# Altium project PCB_Project.PrjPcb
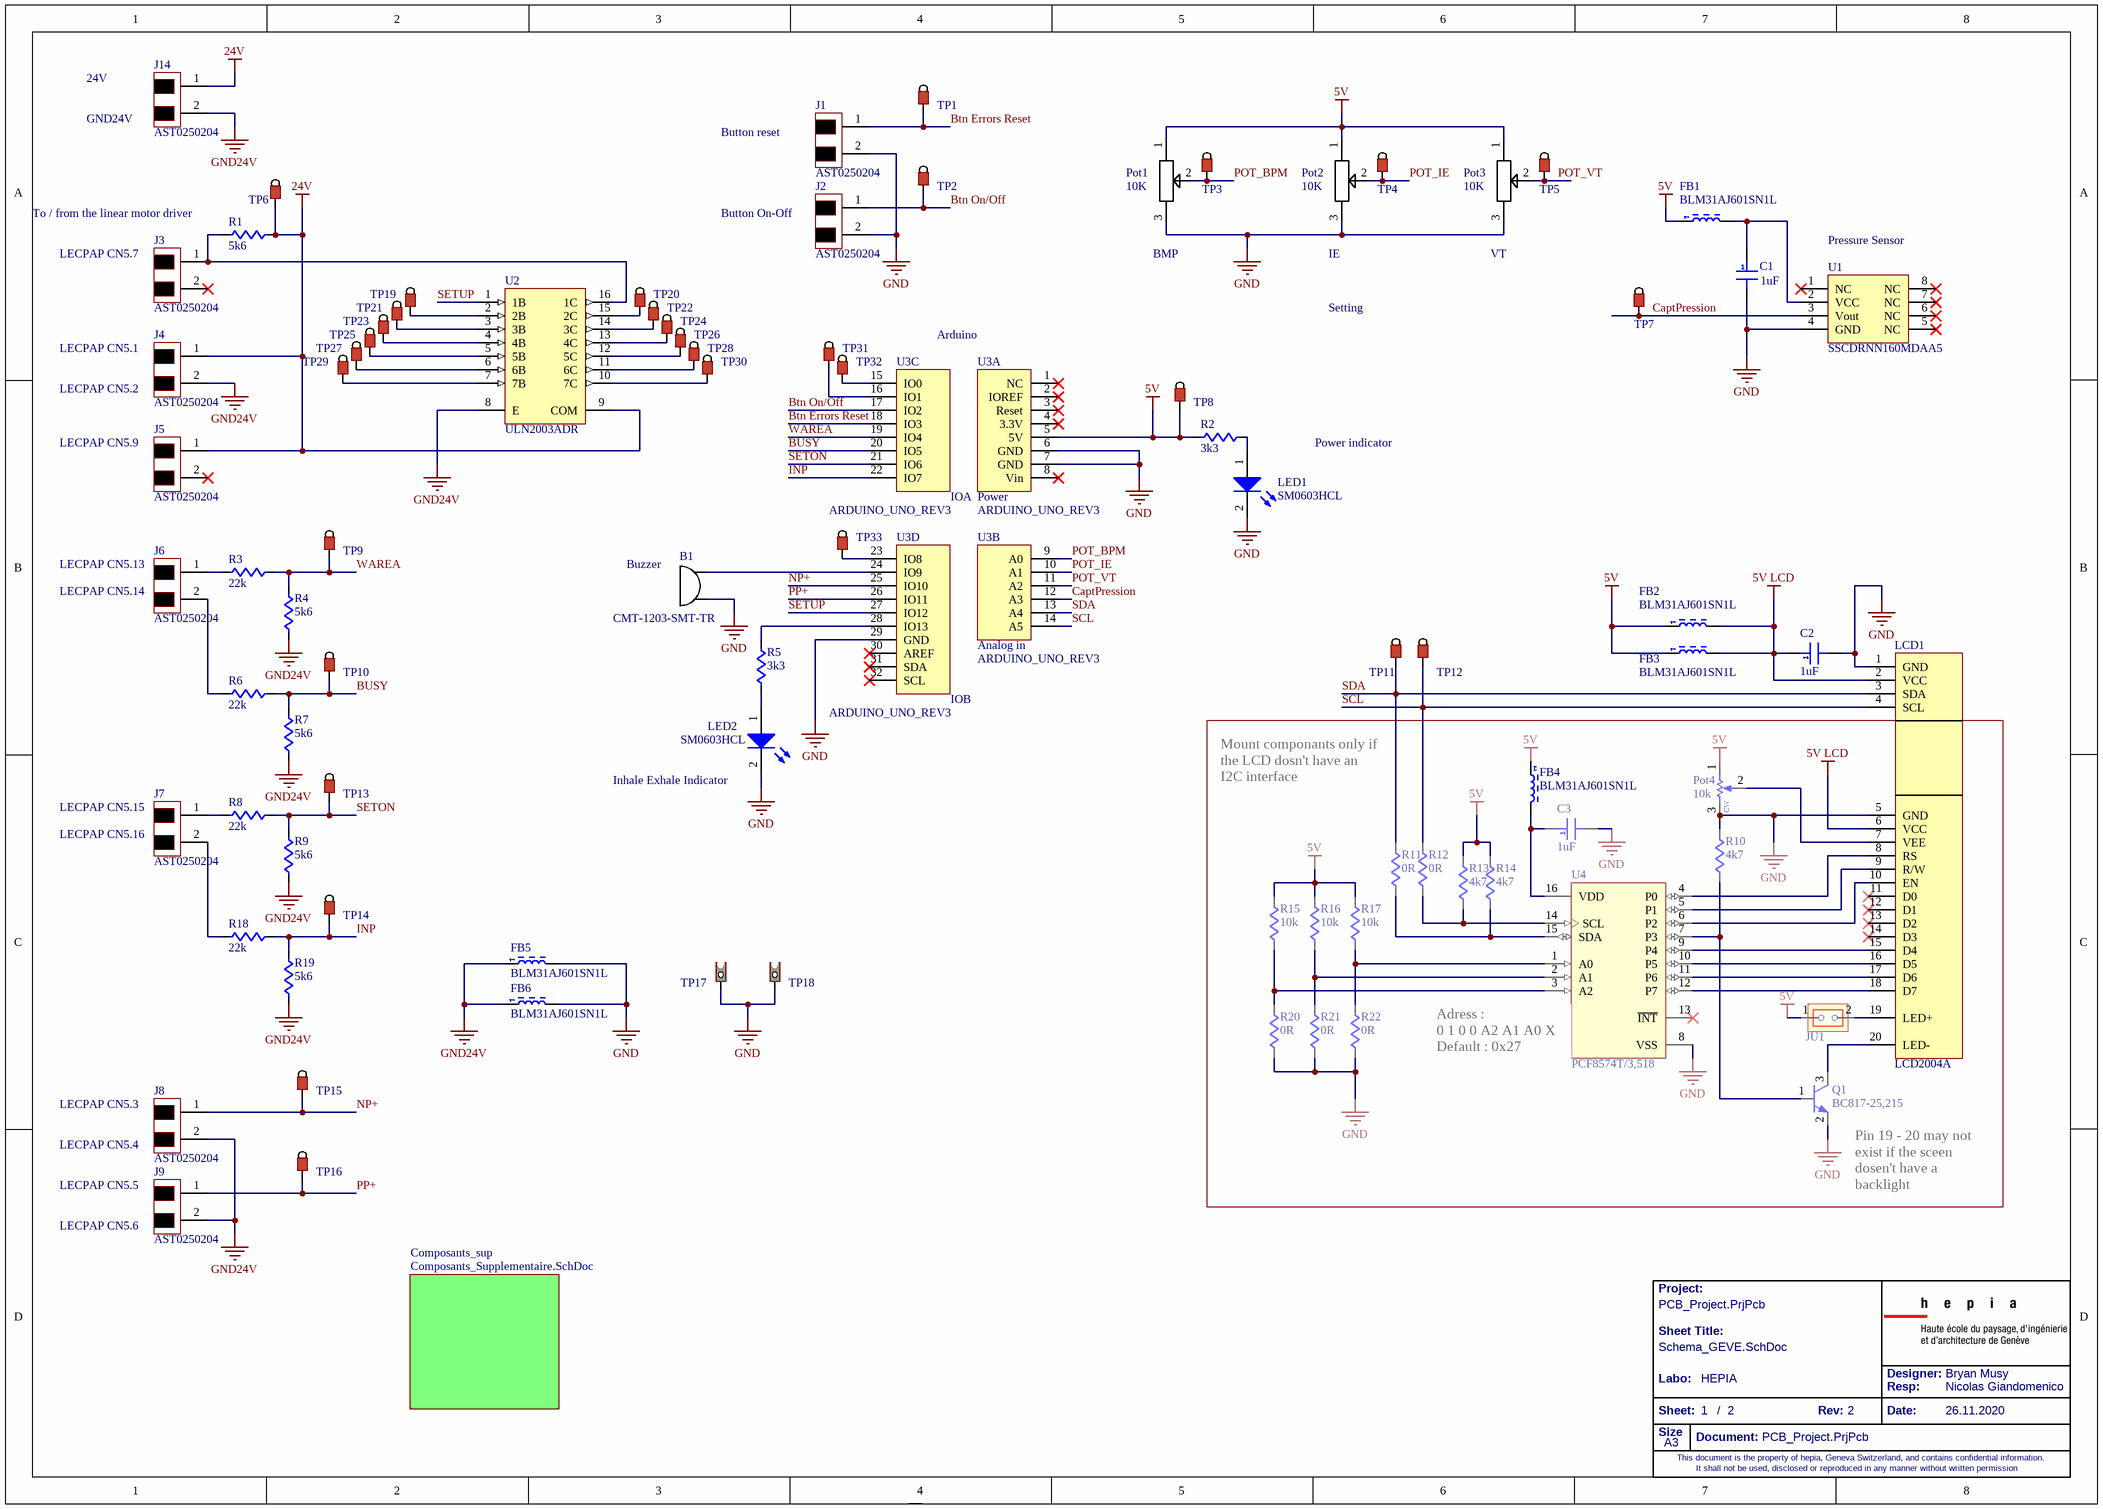
[diagram p0: Schema_GEVE.SchDoc]
2 sheets, 103 parts. Net scope: global (net labels, ports and power ports of the same name join across sheets).
Board file: PCB_GEVE.PcbDoc
Sheets:
  Schema_GEVE.SchDoc
    Composants_sup = Composants_Supplementaire.SchDoc

## Sheet Schema_GEVE.SchDoc: GEVE-Ventilator
size A3; Date: 26.11.2020; ApprovedBy: Nicolas Giandomenico; CheckedBy: Nicolas Giandomenico; Author: Bryan Musy; CompanyName: HEPIA; DrawnBy: Bryan Musy; Organization: HEPIA; Revision: 2; SheetNumber: 1; SheetTotal: 2

### Parts
(Parts that share a designator on the sheet are numbered #1, #2 ... from top to bottom, then left to right.)
?#1  (no value)
?#2  (no value)
B1  CMT-1203-SMT-TR  [CMT-1203-SMT-TR]
C1  1uF  [CAP_0603H0.8]
C2  1uF  [CAP_0603H0.8]
C3  1uF  [CAP_0603H0.8]
FB1  BLM31AJ601SN1L  [FERRITE_1206_1.1]
FB2  BLM31AJ601SN1L  [FERRITE_1206_1.1]
FB3  BLM31AJ601SN1L  [FERRITE_1206_1.1]
FB4  BLM31AJ601SN1L  [FERRITE_1206_1.1]
FB5  BLM31AJ601SN1L  [FERRITE_1206_1.1]
FB6  BLM31AJ601SN1L  [FERRITE_1206_1.1]
J1  AST0250204  [AST0250204]
J2  AST0250204  [AST0250204]
J3  AST0250204  [AST0250204]
J4  AST0250204  [AST0250204]
J5  AST0250204  [AST0250204]
J6  AST0250204  [AST0250204]
J7  AST0250204  [AST0250204]
J8  AST0250204  [AST0250204]
J9  AST0250204  [AST0250204]
J14  AST0250204  [AST0250204]
JU1  PREC002SAAN-RC  [Jumper_2P_P2.54]  (value not drawn)
LCD1  LCD2004A  [LCD2004]
LED1  SM0603HCL  [LED_0603-12]
LED2  SM0603HCL  [LED_0603-12]
Pot1  10K  [PCW1J-B28-BAB103L]
Pot2  10K  [PCW1J-B28-BAB103L]
Pot3  10K  [PCW1J-B28-BAB103L]
Pot4  10k  [Trimpot-3313-J1]
Q1  BC817-25,215  [SOT23-3]
R1  5k6  [RES_0603]
R2  3k3  [RES_0603]
R3  22k  [RES_0603]
R4  5k6  [RES_0603]
R5  3k3  [RES_0603]
R6  22k  [RES_0603]
R7  5k6  [RES_0603]
R8  22k  [RES_0603]
R9  5k6  [RES_0603]
R10  4k7  [RES_0603]
R11  0R  [RES_0603]
R12  0R  [RES_0603]
R13  4k7  [RES_0603]
R14  4k7  [RES_0603]
R15  10k  [RES_0603]
R16  10k  [RES_0603]
R17  10k  [RES_0603]
R18  22k  [RES_0603]
R19  5k6  [RES_0603]
R20  0R  [RES_0603]
R21  0R  [RES_0603]
R22  0R  [RES_0603]
TP1  TP_HOOK  [TP_HOOK]  (value not drawn)
TP2  TP_HOOK  [TP_HOOK]  (value not drawn)
TP3  TP_HOOK  [TP_HOOK]  (value not drawn)
TP4  TP_HOOK  [TP_HOOK]  (value not drawn)
TP5  TP_HOOK  [TP_HOOK]  (value not drawn)
TP6  TP_HOOK  [TP_HOOK]  (value not drawn)
TP7  TP_HOOK  [TP_HOOK]  (value not drawn)
TP8  TP_HOOK  [TP_HOOK]  (value not drawn)
TP9  TP_HOOK  [TP_HOOK]  (value not drawn)
TP10  TP_HOOK  [TP_HOOK]  (value not drawn)
TP11  TP_HOOK  [TP_HOOK]  (value not drawn)
TP12  TP_HOOK  [TP_HOOK]  (value not drawn)
TP13  TP_HOOK  [TP_HOOK]  (value not drawn)
TP14  TP_HOOK  [TP_HOOK]  (value not drawn)
TP15  TP_HOOK  [TP_HOOK]  (value not drawn)
TP16  TP_HOOK  [TP_HOOK]  (value not drawn)
TP17  TP_PLATE  [TP_PLATE]  (value not drawn)
TP18  TP_PLATE  [TP_PLATE]  (value not drawn)
TP19  TP_HOOK  [TP_HOOK]  (value not drawn)
TP20  TP_HOOK  [TP_HOOK]  (value not drawn)
TP21  TP_HOOK  [TP_HOOK]  (value not drawn)
TP22  TP_HOOK  [TP_HOOK]  (value not drawn)
TP23  TP_HOOK  [TP_HOOK]  (value not drawn)
TP24  TP_HOOK  [TP_HOOK]  (value not drawn)
TP25  TP_HOOK  [TP_HOOK]  (value not drawn)
TP26  TP_HOOK  [TP_HOOK]  (value not drawn)
TP27  TP_HOOK  [TP_HOOK]  (value not drawn)
TP28  TP_HOOK  [TP_HOOK]  (value not drawn)
TP29  TP_HOOK  [TP_HOOK]  (value not drawn)
TP30  TP_HOOK  [TP_HOOK]  (value not drawn)
TP31  TP_HOOK  [TP_HOOK]  (value not drawn)
TP32  TP_HOOK  [TP_HOOK]  (value not drawn)
TP33  TP_HOOK  [TP_HOOK]  (value not drawn)
U1  SSCDRNN160MDAA5  [DIP8 SSC Series]
U2  ULN2003ADR  [D0016A_M]
U3  ARDUINO_UNO_REV3  [ARDUINO_A000066]  (parts A,B,C,D of 4)
U4  PCF8574T/3,518  [FP-SOT162-1-MFG]

### Sub-sheets
Composants_sup = Composants_Supplementaire.SchDoc: no entries

### Nets
5V: FB1.1 FB2.1 FB3.1 FB4.1 JU1.1 Pot1.1 Pot2.1 Pot3.1 Pot4.1(CCW) R2.1 R13.1 R14.1 R15.1 R16.1 R17.1 TP8.1 U3.5(5V)
5V LCD: C2.1 FB2.2 FB3.2 LCD1.2(VCC) LCD1.6(VCC)
24V: J4.1 J5.1 J14.1 R1.2 TP6.1 U2.9(COM)
GND: B1.1 C1.2 C2.2 C3.2 FB5.2 FB6.2 J1.2 J2.2 LCD1.1(GND) LCD1.5(GND) LED1.2(K) LED2.2(K) Pot1.3 Pot2.3 Pot3.3 Pot4.3(CW) Q1.2(E) R10.1 R20.2 R21.2 R22.2 TP17.1 TP18.1 U1.4(GND) U3.6(GND) U3.7(GND) U3.29(GND) U4.8(VSS)
GND24V: FB5.1 FB6.1 J4.2 J8.2 J9.2 J14.2 R4.2 R7.2 R9.2 R19.2 U2.8(E)
Btn Errors Reset: J1.1 TP1.1 U3.18(IO3)
Btn On/Off: J2.1 TP2.1 U3.17(IO2)
BUSY: R6.2 R7.1 TP10.1 U3.20(IO5)
CaptPression: TP7.1 U1.3(Vout) U3.12(A3)
INP: R18.2 R19.1 TP14.1 U3.22(IO7)
NP+: J8.1 TP15.1 U3.25(IO10)
POT_BPM: Pot1.2 TP3.1 U3.9(A0)
POT_IE: Pot2.2 TP4.1 U3.10(A1)
POT_VT: Pot3.2 TP5.1 U3.11(A2)
PP+: J9.1 TP16.1 U3.26(IO11)
SCL: LCD1.4(SCL) R12.1 TP12.1 U3.14(A5)
SDA: LCD1.3(SDA) R11.1 TP11.1 U3.13(A4)
SETON: R8.2 R9.1 TP13.1 U3.21(IO6)
SETUP: U2.1(1B) U3.27(IO12)
WAREA: R3.2 R4.1 TP9.1 U3.19(IO4)
NetB1_2: B1.2 U3.24(IO9)
NetC1_1: C1.1 FB1.2 U1.2(VCC)
NetC3_1: C3.1 FB4.2 U4.16(VDD)
NetJ3_1: J3.1 R1.1 U2.16(1C)
NetJ6_1: J6.1 R3.1
NetJ6_2: J6.2 R6.1
NetJ7_1: J7.1 R8.1
NetJ7_2: J7.2 R18.1
NetJU1_2: JU1.2 LCD1.19(LED+)
NetLCD1_7: LCD1.7(VEE) Pot4.2(WIPER)
NetLCD1_8: LCD1.8(RS) U4.4(P0)
NetLCD1_9: LCD1.9(R/W) U4.5(P1)
NetLCD1_10: LCD1.10(EN) U4.6(P2)
NetLCD1_15: LCD1.15(D4) U4.9(P4)
NetLCD1_16: LCD1.16(D5) U4.10(P5)
NetLCD1_17: LCD1.17(D6) U4.11(P6)
NetLCD1_18: LCD1.18(D7) U4.12(P7)
NetLCD1_20: LCD1.20(LED-) Q1.3(C)
NetLED1_1: LED1.1(A) R2.2
NetLED2_1: LED2.1(A) R5.2
NetQ1_1: Q1.1(B) R10.2 U4.7(P3)
NetR5_1: R5.1 U3.28(IO13)
NetR11_2: R11.2 R14.2 U4.15(SDA)
NetR12_2: R12.2 R13.2 U4.14(SCL)
NetR15_2: R15.2 R20.1 U4.3(A2)
NetR16_2: R16.2 R21.1 U4.2(A1)
NetR17_2: R17.2 R22.1 U4.1(A0)
NetTP19_1: TP19.1 U2.2(2B)
NetTP20_1: TP20.1 U2.15(2C)
NetTP21_1: TP21.1 U2.3(3B)
NetTP22_1: TP22.1 U2.14(3C)
NetTP23_1: TP23.1 U2.4(4B)
NetTP24_1: TP24.1 U2.13(4C)
NetTP25_1: TP25.1 U2.5(5B)
NetTP26_1: TP26.1 U2.12(5C)
NetTP27_1: TP27.1 U2.6(6B)
NetTP28_1: TP28.1 U2.11(6C)
NetTP29_1: TP29.1 U2.7(7B)
NetTP30_1: TP30.1 U2.10(7C)
NetTP31_1: TP31.1 U3.16(IO1)
NetTP32_1: TP32.1 U3.15(IO0)
NetTP33_1: TP33.1 U3.23(IO8)

Not connected (* = marked no-connect by the designer): J3 2*; J5 2*; LCD1 11(D0)* 12(D1)* 13(D2)* 14(D3)*; U1 1(NC)* 5(NC)* 6(NC)* 7(NC)* 8(NC)*; U3 1(NC)* 2(IOREF)* 3(Reset)* 4(3.3V)* 8(Vin)* 30(AREF)* 31(SDA)* 32(SCL)*; U4 13(~{INT})*

### Notes on the sheet
- 24V
- GND24V
- (near J1) Button reset
- (near R1) To / from the linear motor driver
- (near J2) Button On-Off
- (near U1) Pressure Sensor
- (near J3) LECPAP CN5.7
- (near Pot1) BMP
- (near Pot2) IE
- Setting
- (near Pot3) VT
- LECPAP CN5.1
- Arduino
- LECPAP CN5.2
- LECPAP CN5.9
- Power indicator
- (near J6) LECPAP CN5.13
- (near B1) Buzzer
- (near J6) LECPAP CN5.14
- (near LED2) Inhale Exhale Indicator
- Mount componants only if the LCD dosn't have an I2C interface
- (near J7) LECPAP CN5.15
- (near J7) LECPAP CN5.16
- (near U4) Adress :
  0 1 0 0 A2 A1 A0 X
  Default : 0x27
- (near J8) LECPAP CN5.3
- LECPAP CN5.4
- LECPAP CN5.5
- (near Q1) Pin 19 - 20 may not exist if the sceen dosen't have a backlight
- (near J9) LECPAP CN5.6
- Project:
- Sheet Title:
- Labo:
- Resp:
- Designer:
- Size
- Sheet:
- A3
- This document is the property of hepia, Geneva Switzerland, and contains confidential information.
- Document:
- /
- Rev:
- Date:
- It shall not be used, disclosed or reproduced in any manner without written permission
- (in symbol ARDUINOUNOREV3, part A) Power
- (in symbol ARDUINOUNOREV3, part B) Analog in
- (in symbol ARDUINOUNOREV3, part C) IOA
- (in symbol ARDUINOUNOREV3, part D) IOB

### Library data of the parts
?#1 ?#2 = block 2
B1 = CMT-1203-SMT-TR: Manufacturer: CUI Devices; Designer: B.Musy; Footprint Category: *; LastetRevisionDate: 03.11.2020; HelpRUL: https://www.findchips.com/search/CMT-1203-SMT-TR; ManufacturerPN: CMT-1203-SMT-TR; Supplier1: Digi-key; Supplier1PN: 102-2197-1-ND
C1-C3 = D_CAP-64: Boite Labo 0603: Ceramic Cap, 1uF, 10%, 50V, CAP_0603H0.8; Manufacturer: Murata; ManufacturerPN: GRM188R61H105KAALD; Tol (%): 10; Pol: NO; UnitaryCost: 0; Designer: R.Mastrocola; Part Number: D_CAP-64; Value: 1uF; DCVoltage (V): 50V; Type: Ceramic; Footprint Category: SM_CHIP; Supplier1: Mouser; Supplier1PN: 81-GRM188R61H105KALD; Supplier2: Digi-Key; Supplier2PN: 1276-1860-1-ND; LatestRevisionDate: 19.02.2015; Projet: Labo; HelpURL: http://www.findchips.com/search/GRM188R61H105KAALD
FB1-FB6 = D_IND-1: Chip Ferrite Bead, 1206, 200mA, DCRes=0.90ohm, 100MHz_Res=600ohm; Manufacturer: Murata; Value: 0; Tol (%): 25; DCRes (mOhm): 0.9; UnitaryCost: 0.325; Projet: Labo; Designer: FG; Part Number: D_IND-1; Imax(A): 200mA; Footprint Category: SM_CHIP; ManufacturerPN: BLM31AJ601SN1L; Supplier1: Mouser; Supplier1PN: 81-BLM31A601S; Supplier2: -; Supplier2PN: -; LatestRevisionDate: 25.02.2015; HelpURL: http://www.findchips.com/search/BLM31AJ601SN1L
J1-J9 = AST0250204: Manufacturer: METZ Connect USA; Designer: B.Musy; UnitaryCost: 1.5; HelpURL: https://www.findchips.com/search/AST0250204; LastestRevision: 05.11.2020; ManufacturerPN: AST0250204; Supplier1: Digikey; Supplier1PN: 1849-1111-ND
J14 = AST0250204: Connecteur a levier; Manufacturer: METZ Connect USA; Designer: B.Musy; UnitaryCost: 1.5; HelpURL: https://www.findchips.com/search/AST0250204; LastestRevision: 05.11.2020; ManufacturerPN: AST0250204; Supplier1: Digikey; Supplier1PN: 1849-1111-ND
JU1 = M_EME-2: CONN HEADER .100" SNGL STR 2POS; Manufacturer: Sullins Connector Solutions; UnitaryCost: 0.12; Projet: Labo; Designer: R.Mastrocola; Part Number: M_EME-2; Footprint Category: M_Electromechanic; ManufacturerPN: PREC002SAAN-RC; Supplier1: Digi-Key; Supplier1PN: S1012EC-02-ND; Supplier2: -; Supplier2PN: -; LatestRevisionDate: 03.03.2015; HelpURL: http://www.findchips.com/search/PREC002SAAN-RC
LCD1 = LCD2004A: Manufacturer: Geekcreit; ManufacturerPN: LCP; Designer: B.Musy; LastestRevision: 05.11.2020; Supplier1: Banggood; Supplier1Link: https://www.banggood.com/Geekcreit-IIC-I2C-2004-204-20-x-4-Character-LCD-Display-Screen-Module-Blue-Geekcreit-for-Arduino-products-that-work-with-official-Arduino-boards-p-908616.html?akmClientCountry=CH&utm_design=41&utm_source=emarsys&utm_medium=Neworder171109&utm_campaign=trigger-order&utm_content=winna&sc_src=email_2675773&sc_eh=e67184d980d793a21&sc_llid=15736518&sc_lid=105229698&sc_uid=BLRGE8BQiu&cur_warehouse=UK
LED1 LED2 = D_OPT-2: LED red smd 0603 2 mA; Manufacturer: Bivar; UnitaryCost: 0.35; Projet: PoliHVGen; Designer: FG; Part Number: D_OPT-2; Footprint Category: SM_CHIP; ManufacturerPN: SM0603HCL; Supplier1: Mouser; Supplier1PN: 749-SM0603HCL; Supplier2: Digi-Key; Supplier2PN: 492-2524-1-ND; LatestRevisionDate: 18.01.2016; HelpURL: http://www.findchips.com/search/SM0603HCL
Pot1-Pot3 = POT10K: Manufacturer: Bourns.inc; Designer: B.Musy; Value: 10K; HelpURL: https://www.findchips.com/search/PCW1J-B28-BAB103L; LastestRevisionDate: 05.11.2020; ManufacturerPN: PCW1J-B28-BAB103L; Supplier1: Digikey; Supplier1PN: PCW1J-B28-BAB103L-ND
Pot4 = D_RES-331: TrimPot SMD 1 Tour 10k 3mm; Manufacturer: Bourns; ManufacturerPN: 3313J-1-103E; Tol (%): 20; Pwr Rating (W): 0.125; Tcoef (PPM/°C): 100; UnitaryCost: 2.01; Projet: Labo; Designer: JCO; Part Number: D_RES-331; Value: 10k; Footprint Category: SM_MISC; Supplier1: Mouser; Supplier1PN: 652-3313J-1-103E; Supplier2: Digi-Key; Supplier2PN: 3313J-103ECT-ND; LatestRevisionDate: 23.04.2018; HelpURL: http://www.findchips.com/search/3313J-1-103E
Q1 = D_TRS-9: Bipolar NPN, General Purpose, 45V,100MHz, 500mA; Manufacturer: NXP Semi; Type: Bip-NPN; UnitaryCost: 0.13; Projet: PTR; Designer: R.Mastrocola; Part Number: D_TRS-9; Footprint Category: SM_SOT; ManufacturerPN: BC817-25,215; Supplier1: Mouser; Supplier1PN: 771-BC817-25-T/R; Supplier2: Digi-Key; Supplier2PN: 568-1630-1-ND; LatestRevisionDate: 12.04.2016; HelpURL: http://www.findchips.com/search/BC817-25,215
R1 R4 R7 R9 R19 = D_RES-92: Thin Film Resistor, Boite Labo 0603, 5k6 1%; Manufacturer: Vishay; ManufacturerPN: MCT06030C5601FP500; Tol (%): 1; Pwr Rating (W): 0.1; Tcoef (PPM/°C): 18; UnitaryCost: 0.057; Designer: R.Mastrocola; Part Number: D_RES-92; Value: 5k6; Footprint Category: SM_CHIP; Supplier1: Mouser; Supplier1PN: 594-MCT06030C5601FP5; Supplier2: -; Supplier2PN: -; LatestRevisionDate: 16.02.2015; Projet: Labo; HelpURL: http://www.findchips.com/search/MCT06030C5601FP500
R2 R5 = D_RES-86: Thin Film Resistor, Boite Labo 0603, 3k3 1%; Manufacturer: Vishay; ManufacturerPN: MCT06030C3301FP500; Tol (%): 1; Pwr Rating (W): 0.1; Tcoef (PPM/°C): 18; UnitaryCost: 0.057; Designer: R.Mastrocola; Part Number: D_RES-86; Value: 3k3; Footprint Category: SM_CHIP; Supplier1: Mouser; Supplier1PN: 594-MCT06030C3301FP5; Supplier2: -; Supplier2PN: -; LatestRevisionDate: 16.02.2015; Projet: Labo; HelpURL: http://www.findchips.com/search/MCT06030C3301FP500
R3 R6 R8 R18 = D_RES-106: Thin Film Resistor, Boite Labo 0603, 22k 1%; Manufacturer: Vishay; ManufacturerPN: MCT06030C2202FP500; Tol (%): 1; Pwr Rating (W): 0.1; Tcoef (PPM/°C): 18; UnitaryCost: 0.057; Designer: R.Mastrocola; Part Number: D_RES-106; Value: 22k; Footprint Category: SM_CHIP; Supplier1: Mouser; Supplier1PN: 594-MCT06030C2202FP5; Supplier2: -; Supplier2PN: -; LatestRevisionDate: 16.02.2015; Projet: Labo; HelpURL: http://www.findchips.com/search/MCT06030C2202FP500
R10 R13 R14 = D_RES-90: Thin Film Resistor, Boite Labo 0603, 4k7 1%; Manufacturer: Vishay; ManufacturerPN: MCT06030C4701FP500; Tol (%): 1; Pwr Rating (W): 0.1; Tcoef (PPM/°C): 18; UnitaryCost: 0.057; Designer: R.Mastrocola; Part Number: D_RES-90; Value: 4k7; Footprint Category: SM_CHIP; Supplier1: Mouser; Supplier1PN: 594-MCT06030C4701FP5; Supplier2: -; Supplier2PN: -; LatestRevisionDate: 16.02.2015; Projet: Labo; HelpURL: http://www.findchips.com/search/MCT06030C4701FP500
R11 R12 R20-R22 = D_RES-1: Thin Film Resistor, Boite Labo 0603, Jumper 0R; Manufacturer: Vishay; ManufacturerPN: MCT06030Z0000ZP500; Tol (%): 1; Pwr Rating (W): 0.1; Tcoef (PPM/°C): 18; UnitaryCost: 0.047; Designer: R.Mastrocola; Part Number: D_RES-1; Value: 0R; Footprint Category: SM_CHIP; Supplier1: Mouser; Supplier1PN: 594-MCT06030Z0000ZP5; Supplier2: -; Supplier2PN: -; LatestRevisionDate: 16.02.2015; Projet: Labo; HelpURL: http://www.findchips.com/search/MCT06030Z0000ZP500
R15-R17 = D_RES-98: Thin Film Resistor, Boite Labo 0603, 10k 1%; Manufacturer: Vishay; ManufacturerPN: MCT06030C1002FP500; Tol (%): 1; Pwr Rating (W): 0.1; Tcoef (PPM/°C): 18; UnitaryCost: 0.057; Designer: R.Mastrocola; F26: 71-CRW060310K0KEAC; F27: Attention +/- 100ppm; Part Number: D_RES-98; Value: 10k; Footprint Category: SM_CHIP; Supplier1: Mouser; Supplier1PN: 594-MCT06030C1002FP5; Supplier2: -; Supplier2PN: -; LatestRevisionDate: 16.02.2015; Projet: Labo; HelpURL: http://www.findchips.com/search/MCT06030C1002FP500
TP1-TP16 TP19-TP33 = M_TST-2: Test Point Hook Type; Manufacturer: Keystone Electronics; ManufacturerPN: 5001; UnitaryCost: 0.352; Projet: Labo; Designer: R.Mastrocola; Part Number: M_TST-2; Footprint Category: TH_TESTPOINTS; Supplier1: Mouser; Supplier1PN: 534-5001; Supplier2: -; Supplier2PN: -; LatestRevisionDate: 17.02.2015; HelpURL: http://www.findchips.com/search/5001
TP17 TP18 = M_TST-3: Test Point Plate Type (for GND); Manufacturer: Keystone Electronics; ManufacturerPN: 1035; UnitaryCost: 0.198; Projet: Labo; Designer: R.Mastrocola; Part Number: M_TST-3; Footprint Category: TH_TESTPOINTS; Supplier1: Mouser; Supplier1PN: 534-1035; Supplier2: -; Supplier2PN: -; LatestRevisionDate: 17.02.2015; HelpURL: http://www.findchips.com/search/1035
U1 = SSCDRNN160MDAA5: Manufacturer: Honeywell Sensing and Productivity Solutions; Designer: B.Musy; UnitaryCost: 30.96; Footprint Category: *; HelpURL: https://www.findchips.com/search/SSCDRNN160MDAA5; LastestRevisionDate: 03.11.2020; ManufacturerPN: SSCDRNN160MDAA5; Part_Number: *; Supplier1: Digi-Key; Supplier1PN: 480-5448-ND
U2 = CMP-2000-04953-1: High-Voltage, High-Current Darlington Transistor Array, 0.5 A, 50 V, -20 to 70 degC, 16-Pin SOIC (D), Green (RoHS & no Sb/Br), Tape and Reel; Manufacturer: TexasInstruments; Peak DC Collector Current: 0.5A; Package Version: 4040047-6/M, 06/2011; Maximum Collector Emitter Voltage: 50V; Configuration: Array7; Maximum Collector Emitter Saturation Voltage: 1.1@100mA; Rad Hard: No; Packaging: Tape&Reel; Datasheet URL: http://www.ti.com/general/docs/lit/getliterature.tsp?genericPartNumber=uln2003a&fileType=pdf; Package Reference: D16; Category: DarlingtonBJT; Datasheet Version: Rev. O, 01/2016; Manufacturer URL: http://www.ti.com/; Type: NPN; Package Description: 16-Pin Plastic Small Outline, Body 9.9 x 3.9 mm, Pitch 1.27 mm; Mounting: SurfaceMount; Package: 16SOIC; Package URL: http://www.ti.com/lit/ml/mpds178g/mpds178g.pdf
U3 = ARDUINOUNOREV3: ManufacturerPN: A000066; Designer: B.Musy; UnitaryCost: 20.20; HelpURL: https://www.findchips.com/search/A000066; LastestRevisionDate: 05.11.2020; Manufacturer: Arduino; Supplier1: Digikey; Supplier1PN: 1050-1024-ND
U4 = CMP-10112-000010-1: IC I/O EXPANDER I2C 8B 16SOIC; Manufacturer: NXP Semiconductors; Frequency: 100kHz; Max Supply Voltage: 6V; Standoff Height: 0.1mm; Nominal Supply Current: 40uA; Max Junction Temp: +125°C; Min Supply Voltage: 2.5V; Number Of I/Os: 8; Manufacturer Part Number: PCF8574T/3,518; Footprint Url: https://www.nxp.com/docs/en/package-information/SOT162-1.pdf; ComponentLink2URL: https://www.nxp.com/docs/en/data-sheet/PCF8574_PCF8574A.pdf; Automotive: No; Digikey Description: IC I/O EXPANDER I2C 8B 16SOIC; Mouser Description: PCF8574 Series 2.5 - 6V Remote 8-bit I/O Expander for I2C-bus - SOIC-16; Ipc Land Pattern Name: SOIC127P1032X265-16; Interface: I2C; Octopart: https://octopart.com/pcf8574t%2F3%2C518-nxp+semiconductors-10470852; Ambient Temperature Range Low: -40°C; Lead Free: Yes; Device Class L2: Interface ICs; Temperature Range High: +85°C; Device Class L1: Integrated Circuits (ICs); Package: SOT162-1; ComponentLink2Description: Datasheet; Device Class L3: I/O Expanders; Temperature: -40°C to +85°C; Ambient Temperature Range High: +85°C; Height: 2.65mm; Category: IC; RoHS: TRUE; Temperature Range Low: -40°C

## Sheet Composants_Supplementaire.SchDoc: GEVE-Ventilator
size A4; Date: 26.11.2020; ApprovedBy: Nicolas Giandomenico; CheckedBy: Nicolas Giandomenico; Author: Byan Musy; CompanyName: HEPIA; DrawnBy: Byan Musy; Revision: 2; SheetNumber: 2; SheetTotal: 2
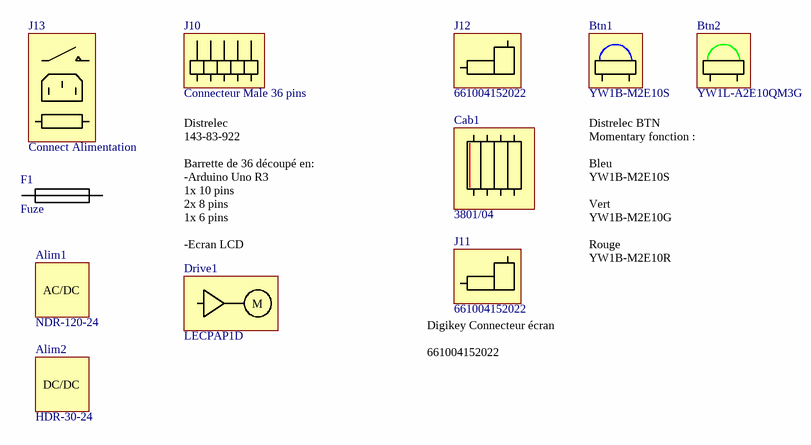
[diagram p1: Composants_Supplementaire.SchDoc]

### Parts
(Parts that share a designator on the sheet are numbered #1, #2 ... from top to bottom, then left to right.)
?#3  (no value)
?#4  (no value)
Alim1  NDR-120-24
Alim2  HDR-30-24
Btn1  YW1B-M2E10S
Btn2  YW1L-A2E10QM3G
Cab1  3801/04
Drive1  LECPAP1D
F1  Fuze
J10  Connecteur Male 36 pins
J11  661004152022
J12  661004152022
J13  Connect Alimentation

### Notes on the sheet
- Distrelec
  143-83-922
  Barrette de 36 découpé en:
  -Arduino Uno R3
  1x 10 pins
  2x 8 pins
  1x 6 pins
  -Ecran LCD
  1x 2 pins
- Distrelec BTN
  Momentary fonction :
  Bleu
  YW1B-M2E10S
  Vert
  YW1B-M2E10G
  Rouge
  YW1B-M2E10R
- (near J11) Digikey Connecteur écran
  661004152022
- Project:
- Sheet Title:
- Labo:
- Resp:
- Designer:
- Size
- Sheet:
- A4
- This document is the property of hepia, Geneva Switzerland, and contains confidential information.
- Document:
- /
- Rev:
- Date:
- It shall not be used, disclosed or reproduced in any manner without written permission
- (in symbol HDR-30-24) DC/DC
- (in symbol LECPAP1D-LEFS25B-200) M
- (in symbol NDR-120-24) AC/DC

### Library data of the parts
?#3 ?#4 = block 2
Alim1 = NDR-120-24: Bloc Alimentation AC/DC 24V 5A; Manufacturer: Mean Well; Designer: B.Musy; LastestRevisionDate: 09.11.2020; ManufacturerPN: NDR-120-24; Supplier1: Mouser; Supplier1PN: 709-NDR120-24; HelpURL: https://www.digikey.ch/product-detail/de/mean-well-usa-inc/NDR-120-24/1866-3518-ND/7705220?utm_campaign=buynow&utm_medium=aggregator&WT.z_cid=ref_findchips_standard&utm_source=findchips; Supplier2: Digikey; Supplier2PN: 1866-3518-ND
Alim2 = HDR-30-24: Bloc Alimentation DC/DC 12V 2A; Manufacturer: MeanWell; Designer: B.Musy; HelpURL: https://www.findchips.com/search/HDR-30-24; LastestRevisionDate: 09.11.2020; ManufacturerPN: HDR-30-24; Supplier1: Mouser; Supplier1PN: 709-HDR30-12; Supplier2PN: 1866-2244-ND; Supplier2: Digikey
Btn1 = YW1B-M2E10S: Bouton bleu; Manufacturer: IDEC; Designer: B.Musy; Help: https://www.findchips.com/search/YW1B-M2E10G; LastestRevisionDate: 09.11.2020; ManufacturerPN: YW1B-M2E10S; Supplier: Distrelec; SupplierPN: 301-02-663
Btn2 = YW1L-A2E10QM3G: Bouton vert; Manufacturer: IDEC; Designer: B.Musy; Help: https://www.findchips.com/search/YW1L-A2E10QM3G; LastestRevisionDate: 09.11.2020; ManufacturerPN: YW1L-A2E10QM3G; Supplier: Distrelec; SupplierPN: 301-02-693
Cab1 = Cables plats 4 fils: Manufacturer: 3M; Designer: B.Musy; LastestRevisionDate: 09.11.2020; ManufacturerPN: 3801/04; Supplier: Digikey; SupplierPN: 3M156838-1-ND
Drive1 = LECPAP1D-LEFS25B-200: Driver step motor; Manufacturer: SMC Pneumatics; Designer: B.Musy; Value: 265; LastestRevisionDate: 09.11.2020; ManufacturerPN: LECPAP1D-LEFS25B-200
F1 = Fusible: Fusible 250V 1.25A; Manufacturer: Eska; ManufacturerPN: 521.018; Desinger: B.Musy; LastestRevisionDate: 09.11.2020; Supplier: Distrelec; SupplierPN: 133-52-296
J10 = Droit Mâle Barrette de circuit imprimé: Barrette 36 pins male; Manufacturer: Preci-Dip; ManufacturerPN: 890-18-036-10-808; Value: 1.97; Designer: *; LastRevision: 06.11.2020; Supplier1: Distrelec; SupplierPN: 143-83-922
J11 J12 = Connecteur 90 ecran: Connecteur 90 4 fils; Manufacturer: Würth Elektronik; UnitaryCost: 0.68; LasterRevisionDate: 06.11.2020; ManufacturerPN: 661004152022; Supplier: Digi-key; SupplierPN: 732-14127-5-ND
J13 = Connecteur Alimentation: Connecteurs d'alimentation Socle; Manufacturer: Bulgin; ManufacturerPN: BZV01/Z0000/01; Designer: B.Musy; LastestRevisionDate: 09.11.2020; Supplier: Digikey; SupplierPN: 708-1880-ND